# Altium schematic sheet ST_LINK_V2.1.SchDoc: ST_LINK_V2-1
size A4; CompanyName: STMicroelectronics; Organization: Microcontrollers Division; SheetNumber: 7; SheetTotal: 8
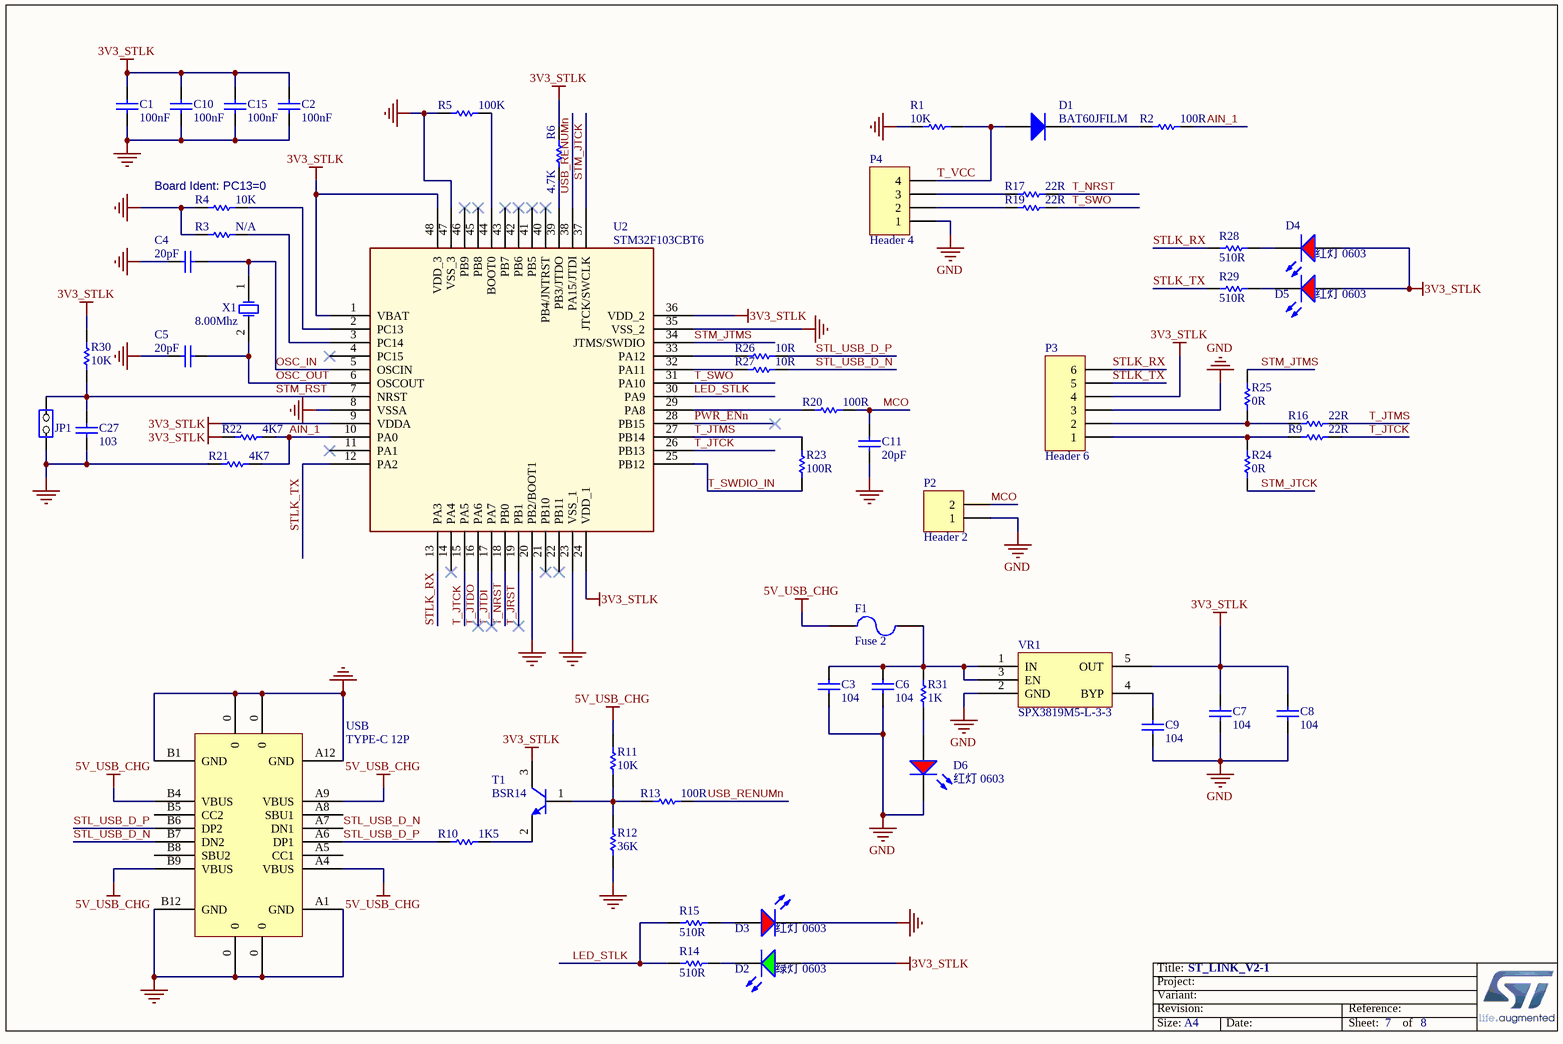
[diagram p0: ST_LINK_V2.1.SchDoc]

## Parts
C1  value 100nF  [0603_C]  (hidden comment: Capacitor)
C2  value 100nF  [0603_C]  (hidden comment: Capacitor)
C3  104  [0603_C]
C4  value 20pF  [0603_C]  (hidden comment: Capacitor)
C5  value 20pF  [0603_C]  (hidden comment: Capacitor)
C6  104  [0603_C]
C7  104  [0603_C]
C8  104  [0603_C]
C9  104  [0603_C]
C10  value 100nF  [0603_C]  (hidden comment: Capacitor)
C11  20pF  [0603_C]
C15  value 100nF  [0603_C]  (hidden comment: Capacitor)
C27  value 103  [0603_C]  (hidden comment: Capacitor)
D1  BAT60JFILM  [SOD-323]
D2  绿灯 0603  [0603_LED_S1]
D3  红灯 0603  [0603_LED_S1]
D4  红灯 0603  [0603_LED_S1]
D5  红灯 0603  [0603_LED_S1]
D6  红灯 0603  [0603_LED_S1]
F1  Fuse 2  [1206_R]
JP1  Jumper Header 2x1  [HDR1X2]  (value not drawn)
P2  Header 2  [HDR1X2]
P3  Header 6  [HDR1X6]
P4  Header 4  [HDR1X4]
R1  value 10K  [0603_R]  (hidden comment: Resistor)
R2  100R  [0603_R]
R3  N/A  [0603_R]
R4  value 10K  [0603_R]  (hidden comment: Resistor)
R5  value 100K  [0603_R]  (hidden comment: Resistor)
R6  value 4.7K  [0603_R]  (hidden comment: Resistor)
R9  value 22R  [0603_R]  (hidden comment: Resistor)
R10  value 1K5  [0603_R]  (hidden comment: Resistor)
R11  value 10K  [0603_R]  (hidden comment: Resistor)
R12  value 36K  [0603_R]  (hidden comment: Resistor)
R13  value 100R  [0603_R]  (hidden comment: Resistor)
R14  value 510R  [0603_R]  (hidden comment: Resistor)
R15  value 510R  [0603_R]  (hidden comment: Resistor)
R16  value 22R  [0603_R]  (hidden comment: Resistor)
R17  value 22R  [0603_R]  (hidden comment: Resistor)
R19  value 22R  [0603_R]  (hidden comment: Resistor)
R20  value 100R  [0603_R]  (hidden comment: Resistor)
R21  value 4K7  [0603_R]  (hidden comment: Resistor)
R22  value 4K7  [0603_R]  (hidden comment: Resistor)
R23  value 100R  [0603_R]  (hidden comment: Resistor)
R24  value 0R  [0603_R]  (hidden comment: Resistor)
R25  value 0R  [0603_R]  (hidden comment: Resistor)
R26  value 10R  [0603_R]  (hidden comment: Resistor)
R27  value 10R  [0603_R]  (hidden comment: Resistor)
R28  value 510R  [0603_R]  (hidden comment: Resistor)
R29  value 510R  [0603_R]  (hidden comment: Resistor)
R30  value 10K  [0603_R]  (hidden comment: Resistor)
R31  value 1K  [0603_R]  (hidden comment: Resistor)
T1  Manufacturer_Part_Number: BSR14  [SOT-23(SOT-23-3)]  (hidden comment: 9013-SOT23)
U2  STM32F103CBT6  [LQFP-48_7x7x05P]
USB  TYPE-C 12P  [TYPE-C 12P 贴片]
VR1  SPX3819M5-L-3-3  [SOT-23-5]
X1  value 8.00Mhz  [SMD-5032_2P]  (hidden comment: XTAL_8M_NX3225GD)

## Nets
3V3_STLK: C1.2 C2.2 C7.2 C8.2 C10.2 C15.2 D2.A D4.A D5.A P3.4 R6.2 R22.1 R30.2 T1.3(C) U2.1(VBAT) U2.9(VDDA) U2.24(VDD_1) U2.36(VDD_2) U2.48(VDD_3) VR1.5(OUT)
5V_USB_CHG: F1.1 R11.2 USB.A4(VBUS) USB.A9(VBUS) USB.B4(VBUS) USB.B9(VBUS)
GND: C1.1 C2.1 C3.1 C4.1 C5.1 C6.1 C7.1 C8.1 C9.1 C10.1 C11.2 C15.1 C27.2 D3.K D6.K JP1.2(NO) P2.1 P3.3 P4.1 R1.2 R3.1 R4.1 R5.1 R12.1 R21.1 U2.8(VSSA) U2.20(PB2/BOOT1) U2.23(VSS_1) U2.35(VSS_2) U2.47(VSS_3) USB.0 USB.A1(GND) USB.A12(GND) USB.B1(GND) USB.B12(GND) VR1.2(GND)
AIN_1: R2.2 R21.2 R22.2 U2.10(PA0)
LED_STLK: R14.1 R15.1 U2.30(PA9)
MCO: C11.1 P2.2 R20.2
OSC_IN: C4.2 U2.5(OSCIN) X1.1(OSC1)
OSC_OUT: C5.2 U2.6(OSCOUT) X1.2(OSC2)
PWR_ENn: U2.28(PB15)
STL_USB_D_N: R27.2 USB.A7(DN1) USB.B7(DN2)
STL_USB_D_P: R10.1 R26.2 USB.A6(DP1) USB.B6(DP2)
STLK_RX: P3.6 R28.1 U2.13(PA3)
STLK_TX: P3.5 R29.1 U2.12(PA2)
STM_JTCK: R24.1 U2.37(JTCK/SWCLK)
STM_JTMS: R25.2 U2.34(JTMS/SWDIO)
STM_RST: C27.1 JP1.1(COMMON) R30.1 U2.7(NRST)
T_JRST: U2.19(PB1)
T_JTCK: R9.2 U2.15(PA5) U2.26(PB13)
T_JTDI: U2.17(PA7)
T_JTDO: U2.16(PA6)
T_JTMS: R16.2 R23.2 U2.27(PB14)
T_NRST: R17.2 U2.18(PB0)
T_SWDIO_IN: R23.1 U2.25(PB12)
T_SWO: R19.2 U2.31(PA10)
T_VCC: D1.1(A) P4.4 R1.1
USB_RENUMn: R13.2 U2.38(PA15/JTDI)
NetC3_2: C3.2 C6.2 F1.2 R31.1 VR1.1(IN) VR1.3(EN)
NetC9_2: C9.2 VR1.4(BYP)
NetD1_2: D1.2(K) R2.1
NetD2_K: D2.K R14.2
NetD3_A: D3.A R15.2
NetD4_K: D4.K R28.2
NetD5_K: D5.K R29.2
NetD6_A: D6.A R31.2
NetP3_1: P3.1 R9.1 R24.2
NetP3_2: P3.2 R16.1 R25.1
NetP4_2: P4.2 R19.1
NetP4_3: P4.3 R17.1
NetR3_2: R3.2 U2.3(PC14)
NetR4_2: R4.2 U2.2(PC13)
NetR5_2: R5.2 U2.44(BOOT0)
NetR6_1: R6.1 U2.39(PB3/JTDO)
NetR10_2: R10.2 T1.2(E)
NetR11_1: R11.1 R12.2 R13.1 T1.1(B)
NetR20_1: R20.1 U2.29(PA8)
NetR26_1: R26.1 U2.33(PA12)
NetR27_1: R27.1 U2.32(PA11)

Not connected (* = marked no-connect by the designer): U2 4(PC15)* 11(PA1)* 14(PA4)* 21(PB10)* 22(PB11)* 40(PB4/JNTRST)* 41(PB5)* 42(PB6)* 43(PB7)* 45(PB8)* 46(PB9)*; USB A5(CC1) A8(SBU1) B5(CC2) B8(SBU2)

## Notes on the sheet
- (near R4) Board Ident: PC13=0
- 晶振输出
- R24 R25仅在第一次烧烧写stlink固件时使用
- Title:
- Project:
- Size:
- Revision:
- Variant:
- A4
- Date:
- Reference:
- Sheet:
- of

## Library data of the parts
C1 C2 C10 C15 C27 = MCD-00211: Capacitor, MLCC, 100nF, 16V, X7R, 10%, 0603, T=0,8mm; Manufacturer_Part_Number: CC0603KRX7R7BB104; Manufacturer: YAGEO; Provided_By: Subcon; Initial_Board_Reference: mb1319; Internal_Part_Number: MCD-00211; Status: Released; Part_Type: Capacitor; Package: C0603; ComponentLink1Description: Yageo_Capacitor_X7R-series.pdf; ComponentLink1URL: http://tunmcdsvn.tun.st.com/Component_Datasheet_Library/Trunk/Capacitors/Yageo_Capacitor_X7R-series.pdf; ECCN_US: n/a; ECCN_EU: n/a
C3 C6-C9 = 0603 2.7pF (2R7) 0.25pF 50V: 贴片电容; ComponentLink1Description: 供应商链接; ComponentLink1URL: http://www.szlcsc.com/product/details_16831.html; Package: 0603; Supplier: LC; SuppliersPartNumber: C16149
C4 C5 = MCD-00637: Capacitor, MLCC, 10pF, 50V, NPO, 5%, 0603, T=0,8mm; Manufacturer_Part_Number: CC0603JRNPO9BN100; Manufacturer: YAGEO; Provided_By: subcon; Initial_Board_Reference: mb1319; Internal_Part_Number: MCD-00637; Status: Released; Part_Type: Capacitor; Package: C0603; ComponentLink1Description: Yageo_Capacitor_NP0_16V-to-50V.pdf; ComponentLink1URL: http://tunmcdsvn.tun.st.com/Component_Datasheet_Library/Trunk/Capacitors/Yageo_Capacitor_NP0_16V-to-50V.pdf; ECCN_US: n/a; ECCN_EU: n/a
C11 = MCD-00638: Capacitor, MLCC, 20pF, 50V, NPO, 5%, 0603, T=0,8mm; Manufacturer_Part_Number: CC0603JRNPO9BN200; Manufacturer: YAGEO; Provided_By: Subcon; Initial_Board_Reference: mb1319; Internal_Part_Number: MCD-00638; Value: 20pF; Status: Released; Part_Type: Capacitor; Package: C0603; ComponentLink1Description: Yageo_Capacitor_NP0_16V-to-50V.pdf; ECCN_US: n/a; ECCN_EU: n/a; ComponentLink1URL: http://tunmcdsvn.tun.st.com/Component_Datasheet_Library/Trunk/Capacitors/Yageo_Capacitor_NP0_16V-to-50V.pdf
D1 = MCD-00034: Part_Type: Diode; Manufacturer: STMICROELECTRONICS; ECCN_US: EAR99; ECCN_EU: NEC; Provided_By: Subcon; Initial_Board_Reference: mb1274; Internal_Part_Number: MCD-00034; Value: BAT60JFILM; Status: Released; Manufacturer_Part_Number: BAT60JFILM; ComponentLink1Description: STM_Diode_BAT60JFILM-SOD323.pdf; ComponentLink1URL: http://tunmcdsvn.tun.st.com/Component_Datasheet_Library/Trunk/Diodes/STM_Diode_BAT60JFILM-SOD323.pdf
D2 = 0603 绿灯: 发光二极管; ComponentLink1Description: 供应商链接; ComponentLink1URL: http://www.szlcsc.com/product/details_73152.html; Package: 0603; Supplier: LC; SuppliersPartNumber: C72043
D3-D6 = 0603 红灯: 发光二极管; ComponentLink1Description: 供应商链接; ComponentLink1URL: http://www.szlcsc.com/product/details_2659.html; Package: 0603; Supplier: LC; SuppliersPartNumber: C2286
F1 = Fuse 2: Fuse; Published: 8-Jun-2000; LatestRevisionDate: 17-Jul-2002; LatestRevisionNote: Re-released for DXP Platform.; PackageReference: PIN-W2/E2.8; Publisher: Altium Limited; PackageDescription: Thru-Hole; 2 Leads
JP1 = MCD-00045: Header, 2x1, 2,54mm, VR, TH, Height 5.84mm/2.54mm; Part_Type: Connector; Manufacturer_Part_Number: TSW-102-07-x-S; Manufacturer: SAMTEC; Value: Jumper_Header_2x1; Provided_By: Subcon; Initial_Board_Reference: mb1274; Internal_Part_Number: MCD-00045; Status: Released; ComponentLink1Description: Samtec_connector_TSW-HTSW-series.pdf; ComponentLink1URL: http://tunmcdsvn.tun.st.com/Component_Datasheet_Library/Trunk/Connectors/Samtec_connector_TSW-HTSW-series.pdf; ECCN_US: n/a; ECCN_EU: n/a
P2 = Header 2: Header, 2-Pin; LatestRevisionDate: 17-Jul-2002; LatestRevisionNote: Re-released for DXP Platform.; Publisher: Altium Limited
P3 = Header 6: Header, 6-Pin; LatestRevisionDate: 17-Jul-2002; LatestRevisionNote: Re-released for DXP Platform.; Publisher: Altium Limited
P4 = Header 4: Header, 4-Pin; LatestRevisionDate: 17-Jul-2002; LatestRevisionNote: Re-released for DXP Platform.; Publisher: Altium Limited
R1 R3 R4 R11 = MCD-00220: Resistor,10K,0603,1%,1/10W; Manufacturer_Part_Number: RC0603FR-0710KL; Manufacturer: YAGEO; Provided_By: Subcon; Initial_Board_Reference: mb1319; Internal_Part_Number: MCD-00220; Status: Released; Part_Type: Resistor; Package: R0603; ComponentLink1Description: Yageo_Resistor_RC0603-series.pdf; ComponentLink1URL: http://tunmcdsvn.tun.st.com/Component_Datasheet_Library/Trunk/Resistors/Yageo_Resistor_RC0603-series.pdf; ECCN_US: n/a; ECCN_EU: n/a
  R3: Value: 10K
R2 R9 R16 R17 R19 R24 R25 = MCD-00066: Resistor,22R,0603,1%,1/10W; Manufacturer_Part_Number: RC0603FR-0722RL; Manufacturer: YAGEO; Provided_By: Subcon; Initial_Board_Reference: mb1274; Internal_Part_Number: MCD-00066; Status: Released; Part_Type: Resistor; Package: R0603; ComponentLink1Description: Yageo_Resistor_RC0603-series.pdf; ComponentLink1URL: http://tunmcdsvn.tun.st.com/Component_Datasheet_Library/Trunk/Resistors/Yageo_Resistor_RC0603-series.pdf; ECCN_US: n/a; ECCN_EU: n/a
  R2: Value: 22R
R5 R30 = MCD-00223: Resistor,100K,0603,1%,1/10W; Manufacturer_Part_Number: RC0603FR-07100KL; Manufacturer: YAGEO; Provided_By: Subcon; Initial_Board_Reference: mb1319; Internal_Part_Number: MCD-00223; Status: Released; Part_Type: Resistor; Package: R0603; ComponentLink1Description: Yageo_Resistor_RC0603-series.pdf; ComponentLink1URL: http://tunmcdsvn.tun.st.com/Component_Datasheet_Library/Trunk/Resistors/Yageo_Resistor_RC0603-series.pdf; ECCN_US: n/a; ECCN_EU: n/a
R6 R14 R15 R28 R29 R31 = MCD-00197: Resistor,330R,0603,1%,1/10W; Manufacturer_Part_Number: RC0603FR-07330RL; Manufacturer: YAGEO; Provided_By: Subcon; Internal_Part_Number: MCD-00197; Status: Released; Part_Type: Resistor; Package: R0603; ComponentLink1Description: Yageo_Resistor_RC0603-series.pdf; ComponentLink1URL: http://tunmcdsvn.tun.st.com/Component_Datasheet_Library/Trunk/Resistors/Yageo_Resistor_RC0603-series; ECCN_US: n/a; ECCN_EU: n/a
R10 = MCD-00217: Resistor,1K5,0603,1%,1/10W; Manufacturer_Part_Number: RC0603FR-071K5L; Manufacturer: YAGEO; Provided_By: Subcon; Initial_Board_Reference: mb1319; Internal_Part_Number: MCD-00217; Status: Released; Part_Type: Resistor; Package: R0603; ComponentLink1Description: Yageo_Resistor_RC0603-series.pdf; ComponentLink1URL: http://tunmcdsvn.tun.st.com/Component_Datasheet_Library/Trunk/Resistors/Yageo_Resistor_RC0603-series.pdf; ECCN_US: n/a; ECCN_EU: n/a
R12 = MCD-00221: Resistor,36K,0603,1%,1/10W; Manufacturer_Part_Number: RC0603FR-0736KL; Manufacturer: YAGEO; Provided_By: Subcon; Initial_Board_Reference: mb1319; Internal_Part_Number: MCD-00221; Status: Released; Part_Type: Resistor; Package: R0603; ComponentLink1Description: Yageo_Resistor_RC0603-series.pdf; ComponentLink1URL: http://tunmcdsvn.tun.st.com/Component_Datasheet_Library/Trunk/Resistors/Yageo_Resistor_RC0603-series.pdf; ECCN_US: n/a; ECCN_EU: n/a
R13 R20 R23 R26 R27 = MCD-00224: Resistor,100R,0603,1%,1/10W; Manufacturer_Part_Number: RC0603FR-07100RL; Manufacturer: YAGEO; Provided_By: Subcon; Initial_Board_Reference: mb1319; Internal_Part_Number: MCD-00224; Status: Released; Part_Type: Resistor; Package: R0603; ComponentLink1Description: Yageo_Resistor_RC0603-series.pdf; ComponentLink1URL: http://tunmcdsvn.tun.st.com/Component_Datasheet_Library/Trunk/Resistors/Yageo_Resistor_RC0603-series.pdf; ECCN_US: n/a; ECCN_EU: n/a
R21 R22 = MCD-00219: Resistor,4K7,0603,1%,1/10W; Manufacturer_Part_Number: RC0603FR-074K7L; Manufacturer: YAGEO; Provided_By: Subcon; Initial_Board_Reference: mb1319; Internal_Part_Number: MCD-00219; Status: Released; Part_Type: Resistor; Package: R0603; ComponentLink1Description: Yageo_Resistor_RC0603-series.pdf; ComponentLink1URL: http://tunmcdsvn.tun.st.com/Component_Datasheet_Library/Trunk/Resistors/Yageo_Resistor_RC0603-series.pdf; ECCN_US: n/a; ECCN_EU: n/a
T1 = MCD-00073: NPN Bipolar Transistor; Part_Type: IC; Manufacturer: NXP; ECCN_US: EAR99; ECCN_EU: NEC; Provided_By: Subcon; Initial_Board_Reference: mb1274; Revision: *; Internal_Part_Number: MCD-00073; Value: 9013-SOT23; Status: Released; ComponentLink1Description: NXP_Transistor_BSR14.pdf; ComponentLink1URL: http://tunmcdsvn.tun.st.com/Component_Datasheet_Library/Trunk/IC/NXP_Transistor_BSR14.pdf
U2 = MCD-00085: Medium-density performance line ARM-based 32-bit MCU with 128KB Flash; Manufacturer: STMICROELECTRONICS; Part_Type: IC; ECCN_US: 3A991A2; ECCN_EU: NEC; Provided_By: Subcon; Initial_Board_Reference: mb1274; Value: STM32F103CBT6; Internal_Part_Number: MCD-00085; Manufacturer_Part_Number: STM32F103CBT6; ComponentLink1Description: STM_STM32F103CBT6.pdf; Status: Released; ComponentLink1URL: http://tunmcdsvn.tun.st.com/Component_Datasheet_Library/Trunk/IC/STM_STM32F103CBT6.pdf
VR1 = SPX3819M5-L-3-3: LDO
X1 = MCD-00092: Crystal 8Mhz, 8pF, -+50PPM, SMD; Part_Type: Crystal_Osc; Manufacturer_Part_Number: NX3225GD 8MHz EXS00A-CG04874; Manufacturer: NDK; ECCN_US: EAR99; ECCN_EU: NEC; Provided_By: STM; Initial_Board_Reference: mb1274; Internal_Part_Number: MCD-00092; Status: Released; ComponentLink1Description: NDK_Crystal-For-ST_NX3225GD 8MHz EXS00A-CG04874 (EXS10B-20725).pdf; ComponentLink1URL: http://tunmcdsvn.tun.st.com/Component_Datasheet_Library/Trunk/Crystal_Osc/NDK_Crystal-For-ST_NX3225GD 8MHz EXS00A-CG04874 (EXS10B-20725).pdf